# Altium schematic sheet Sheet1.SchDoc
size A; SheetNumber: 1; SheetTotal: 1
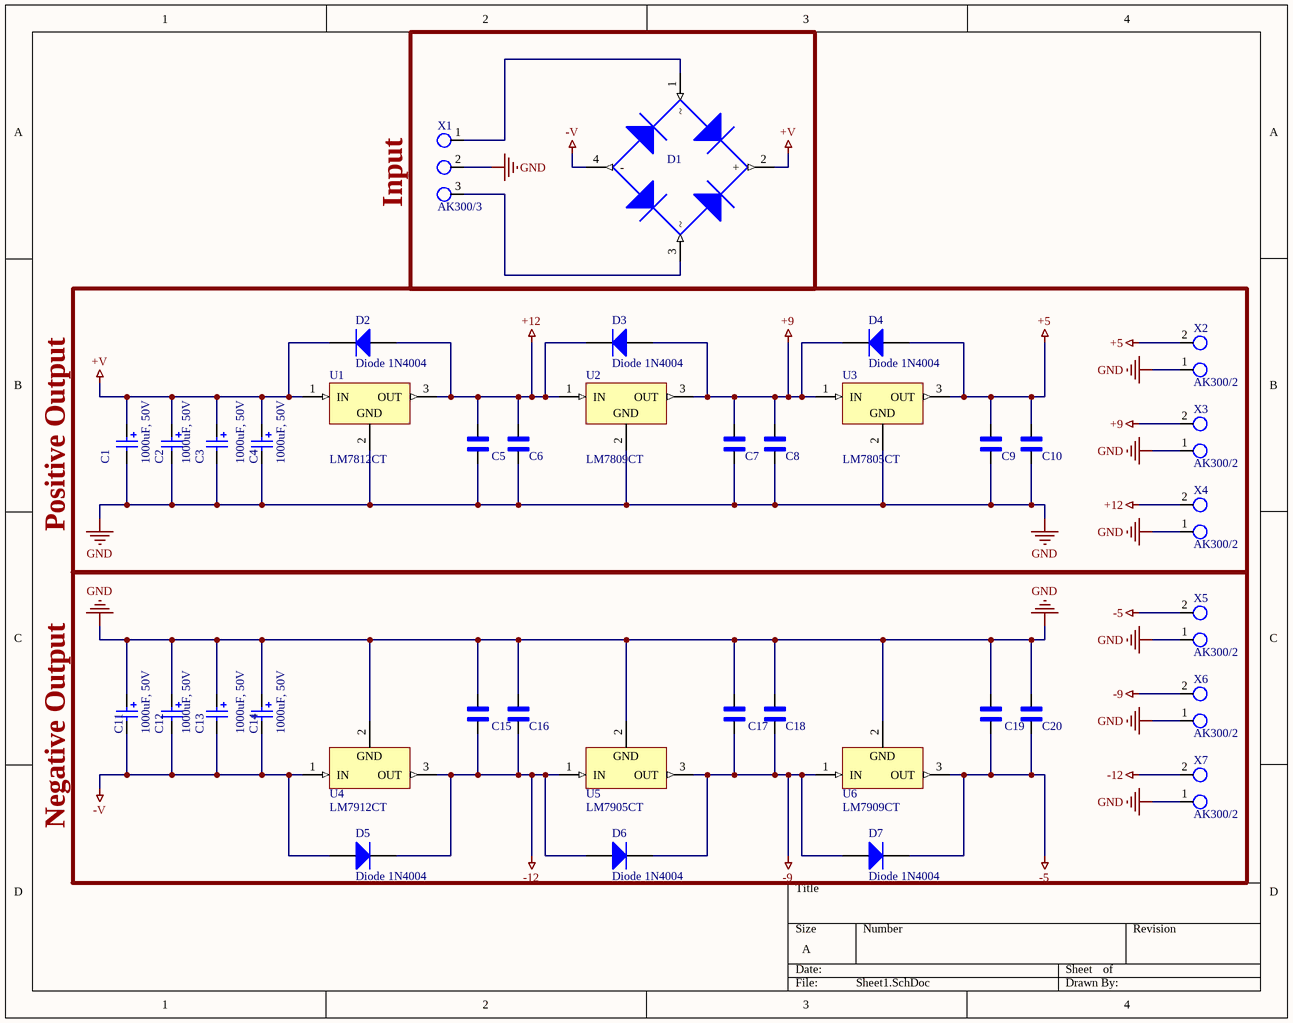
[diagram p0: Sheet1.SchDoc]

## Parts
C1  1000uF, 50V  [WCAP-ATG8_D13H25]
C2  1000uF, 50V  [WCAP-ATG8_D13H25]
C3  1000uF, 50V  [WCAP-ATG8_D13H25]
C4  1000uF, 50V  [WCAP-ATG8_D13H25]
C5  RDE5C2A220J0M1H03A  [CAP_RDE5C2A220J0M1H03A]  (value not drawn)
C6  RDE5C2A220J0M1H03A  [CAP_RDE5C2A220J0M1H03A]  (value not drawn)
C7  RDE5C2A220J0M1H03A  [CAP_RDE5C2A220J0M1H03A]  (value not drawn)
C8  RDE5C2A220J0M1H03A  [CAP_RDE5C2A220J0M1H03A]  (value not drawn)
C9  RDE5C2A220J0M1H03A  [CAP_RDE5C2A220J0M1H03A]  (value not drawn)
C10  RDE5C2A220J0M1H03A  [CAP_RDE5C2A220J0M1H03A]  (value not drawn)
C11  1000uF, 50V  [WCAP-ATG8_D13H25]
C12  1000uF, 50V  [WCAP-ATG8_D13H25]
C13  1000uF, 50V  [WCAP-ATG8_D13H25]
C14  1000uF, 50V  [WCAP-ATG8_D13H25]
C15  RDE5C2A220J0M1H03A  [CAP_RDE5C2A220J0M1H03A]  (value not drawn)
C16  RDE5C2A220J0M1H03A  [CAP_RDE5C2A220J0M1H03A]  (value not drawn)
C17  RDE5C2A220J0M1H03A  [CAP_RDE5C2A220J0M1H03A]  (value not drawn)
C18  RDE5C2A220J0M1H03A  [CAP_RDE5C2A220J0M1H03A]  (value not drawn)
C19  RDE5C2A220J0M1H03A  [CAP_RDE5C2A220J0M1H03A]  (value not drawn)
C20  RDE5C2A220J0M1H03A  [CAP_RDE5C2A220J0M1H03A]  (value not drawn)
D1  2W10G  [2W10G]  (value not drawn)
D2  Diode 1N4004  [DO-41]
D3  Diode 1N4004  [DO-41]
D4  Diode 1N4004  [DO-41]
D5  Diode 1N4004  [DO-41]
D6  Diode 1N4004  [DO-41]
D7  Diode 1N4004  [DO-41]
U1  LM7812CT  [TO-220-P]
U2  LM7809CT  [TO-220-P]
U3  LM7805CT  [TO-220-P]
U4  LM7912CT  [TO-220-N]
U5  LM7905CT  [TO-220-N]
U6  LM7909CT  [TO-220-N]
X1  AK300/3  [AK300/3]
X2  AK300/2  [AK300/2]
X3  AK300/2  [AK300/2]
X4  AK300/2  [AK300/2]
X5  AK300/2  [AK300/2]
X6  AK300/2  [AK300/2]
X7  AK300/2  [AK300/2]

## Blocks framed on the sheet
Input: D1 X1
Positive Output: C1-C10 D2-D4 U1-U3 X2-X4
Negative Output: C11-C20 D5-D7 U4-U6 X5-X7

## Nets
+5: C9.2 C10.2 D4.1(A) U3.3(OUT) X2.2(KL)
+9: C7.2 C8.2 D3.1(A) D4.2(K) U2.3(OUT) U3.1(IN) X3.2(KL)
+12: C5.2 C6.2 D2.1(A) D3.2(K) U1.3(OUT) U2.1(IN) X4.2(KL)
+V: C1.1(P) C2.1(P) C3.1(P) C4.1(P) D1.2(+) D2.2(K) U1.1(IN)
-5: C19.1 C20.1 D7.2(K) U6.3(OUT) X5.2(KL)
-9: C17.1 C18.1 D6.2(K) D7.1(A) U5.3(OUT) U6.1(IN) X6.2(KL)
-12: C15.1 C16.1 D5.2(K) D6.1(A) U4.3(OUT) U5.1(IN) X7.2(KL)
-V: C11.2(N) C12.2(N) C13.2(N) C14.2(N) D1.4(-) D5.1(A) U4.1(IN)
GND: C1.2(N) C2.2(N) C3.2(N) C4.2(N) C5.1 C6.1 C7.1 C8.1 C9.1 C10.1 C11.1(P) C12.1(P) C13.1(P) C14.1(P) C15.2 C16.2 C17.2 C18.2 C19.2 C20.2 U1.2(GND) U2.2(GND) U3.2(GND) U4.2(GND) U5.2(GND) U6.2(GND) X1.2(KL) X2.1(KL) X3.1(KL) X4.1(KL) X5.1(KL) X6.1(KL) X7.1(KL)
NetD1_1: D1.1 X1.1(KL)
NetD1_3: D1.3 X1.3(KL)

## Library data of the parts
C1-C4 C11-C14 = 860010678024: WCAP-ATG8 Aluminum Electrolytic Capacitor, Radial, THT, D13xH25, 1000uF, 50V; Manufacturer: Wurth Elektronik; Ripple Current: 1485mA; Rated Voltage: 50VDC; Technical Reference: ATBI250102M050DSPACB000; Leakage Current: 500uA; Endurance: 2000h; Dissipation Factor: 10%; Capacitance Tolerance: +/-20%; ComponentLink2Description: Datasheet; Published Date: October 2020; Packaging: Ammo Pack; Operating Temperature: -40 to +85degC; Mounting Technology: THT; Manufacturer Part Number: 860010678024; Height: 25mm; Diameter: 13mm; ComponentLink2URL: https://www.we-online.com/catalog/datasheet/860010678024.pdf; ComponentLink1URL: http://www.we-online.de; ComponentLink1Description: Manufacturer; Capacitance: 1000uF
C5-C10 C15-C20 = RDE5C2A220J0M1H03A: Lead Capacitor C0G_EIA_ with Capacitance: 22pF and Rated Voltage: 100Vdc; MF: Murata; Availability: Unavailable; Price: None; Package: Radial Murata; Value: *; SnapEDA_Link: https://www.snapeda.com/parts/RDE5C2A220J0M1H03A/Murata/view-part/4545539/?ref=snap; MP: RDE5C2A220J0M1H03A
D2-D7 = Diode 1N4004: 1 Amp General Purpose Rectifier; Published: 8-Jun-2000; LatestRevisionDate: 17-Jul-2002; LatestRevisionNote: Re-released for DXP Platform.; DatasheetVersion: 1998; PackageVersion: Aug-1999; PackageReference: DO-41; Publisher: Altium Limited; PackageDescription: Diode, Axial; Body 5.2 x 2.7 mm (LxDia. max), Lead Dia. 0.86 mm (max); Code_JEDEC: DO-204-AL; ComponentLink1Description: Manufacturer Link; ComponentLink1URL: http://www.fairchildsemi.com/; ComponentLink2Description: Datasheet; ComponentLink2URL: http://www.fairchildsemi.com/ds/1N%2F1N4001.pdf
U1 = 7812: Manufacturer: FairchildSemiconductor; Maximum Input Voltage: 35V; Maximum Quiescent Current: 8mA; Load Regulation: 100mV; Polarity: Positive; Maximum Output Current: 2.2(Typ)A; Output Type: Fixed; Typical Dropout Voltage @ Current: 2@1AV; Rad Hard: No; Output Voltage: 5V; Accuracy: ±4%; Number of Outputs: 1; Category: LinearRegulator; Package Description: 3-Pin Through Hole Device, Body 10 x 4.5 mm, Pitch 2.54 mm; Packaging: Rail/Tube; Mounting: ThroughHole; Manufacturer URL: https://www.fairchildsemi.com/; Line Regulation: 100mV; Datasheet Version: Aug-12; Datasheet URL: https://datasheet.ciiva.com/26904/lm7805ct-26904988.pdf; Package Reference: TO-220; Package URL: https://www.fairchildsemi.com/package-drawings/TO/TO220B03.pdf; Package: 3TO-220AB; Operating Temperature: -40to125degC; Type: Linear
U2 = 7809: Manufacturer: FairchildSemiconductor; Maximum Input Voltage: 35V; Maximum Quiescent Current: 8mA; Load Regulation: 100mV; Polarity: Positive; Maximum Output Current: 2.2(Typ)A; Output Type: Fixed; Typical Dropout Voltage @ Current: 2@1AV; Rad Hard: No; Output Voltage: 5V; Accuracy: ±4%; Number of Outputs: 1; Category: LinearRegulator; Package Description: 3-Pin Through Hole Device, Body 10 x 4.5 mm, Pitch 2.54 mm; Packaging: Rail/Tube; Mounting: ThroughHole; Manufacturer URL: https://www.fairchildsemi.com/; Line Regulation: 100mV; Datasheet Version: Aug-12; Datasheet URL: https://datasheet.ciiva.com/26904/lm7805ct-26904988.pdf; Package Reference: TO-220; Package URL: https://www.fairchildsemi.com/package-drawings/TO/TO220B03.pdf; Package: 3TO-220AB; Operating Temperature: -40to125degC; Type: Linear
U3 = 7805: Positive Voltage Regulator, 5 V, 1 A, -40 to 125 degC, 3-Pin TO-220, RoHS, Tube; Manufacturer: FairchildSemiconductor; Maximum Input Voltage: 35V; Maximum Quiescent Current: 8mA; Load Regulation: 100mV; Maximum Output Current: 2.2(Typ)A; Output Type: Fixed; Typical Dropout Voltage @ Current: 2@1AV; Rad Hard: No; Output Voltage: 5V; Accuracy: ±4%; Number of Outputs: 1; Category: LinearRegulator; Package Description: 3-Pin Through Hole Device, Body 10 x 4.5 mm, Pitch 2.54 mm; Packaging: Rail/Tube; Mounting: ThroughHole; Polarity: Positive; Manufacturer URL: https://www.fairchildsemi.com/; Line Regulation: 100mV; Datasheet Version: Aug-12; Datasheet URL: https://datasheet.ciiva.com/26904/lm7805ct-26904988.pdf; Package Reference: TO-220; Package URL: https://www.fairchildsemi.com/package-drawings/TO/TO220B03.pdf; Package: 3TO-220AB; Operating Temperature: -40to125degC; Type: Linear
U4 = 7912: Manufacturer: FairchildSemiconductor; Maximum Input Voltage: 35V; Maximum Quiescent Current: 8mA; Load Regulation: 100mV; Polarity: Positive; Maximum Output Current: 2.2(Typ)A; Output Type: Fixed; Typical Dropout Voltage @ Current: 2@1AV; Rad Hard: No; Output Voltage: 5V; Accuracy: ±4%; Number of Outputs: 1; Category: LinearRegulator; Package Description: 3-Pin Through Hole Device, Body 10 x 4.5 mm, Pitch 2.54 mm; Packaging: Rail/Tube; Mounting: ThroughHole; Manufacturer URL: https://www.fairchildsemi.com/; Line Regulation: 100mV; Datasheet Version: Aug-12; Datasheet URL: https://datasheet.ciiva.com/26904/lm7805ct-26904988.pdf; Package Reference: TO-220; Package URL: https://www.fairchildsemi.com/package-drawings/TO/TO220B03.pdf; Package: 3TO-220AB; Operating Temperature: -40to125degC; Type: Linear
U5 = 7905: Negative Voltage Regulator, 5 V, 1 A, -40 to 125 degC, 3-Pin TO-220, RoHS, Tube; Manufacturer: FairchildSemiconductor; Maximum Input Voltage: 35V; Maximum Quiescent Current: 8mA; Load Regulation: 100mV; Polarity: Positive; Maximum Output Current: 2.2(Typ)A; Output Type: Fixed; Typical Dropout Voltage @ Current: 2@1AV; Rad Hard: No; Output Voltage: 5V; Accuracy: ±4%; Number of Outputs: 1; Category: LinearRegulator; Package Description: 3-Pin Through Hole Device, Body 10 x 4.5 mm, Pitch 2.54 mm; Packaging: Rail/Tube; Mounting: ThroughHole; Manufacturer URL: https://www.fairchildsemi.com/; Line Regulation: 100mV; Datasheet Version: Aug-12; Datasheet URL: https://datasheet.ciiva.com/26904/lm7805ct-26904988.pdf; Package Reference: TO-220; Package URL: https://www.fairchildsemi.com/package-drawings/TO/TO220B03.pdf; Package: 3TO-220AB; Operating Temperature: -40to125degC; Type: Linear
U6 = 7909: Manufacturer: FairchildSemiconductor; Maximum Input Voltage: 35V; Maximum Quiescent Current: 8mA; Load Regulation: 100mV; Polarity: Positive; Maximum Output Current: 2.2(Typ)A; Output Type: Fixed; Typical Dropout Voltage @ Current: 2@1AV; Rad Hard: No; Output Voltage: 5V; Accuracy: ±4%; Number of Outputs: 1; Category: LinearRegulator; Package Description: 3-Pin Through Hole Device, Body 10 x 4.5 mm, Pitch 2.54 mm; Packaging: Rail/Tube; Mounting: ThroughHole; Manufacturer URL: https://www.fairchildsemi.com/; Line Regulation: 100mV; Datasheet Version: Aug-12; Datasheet URL: https://datasheet.ciiva.com/26904/lm7805ct-26904988.pdf; Package Reference: TO-220; Package URL: https://www.fairchildsemi.com/package-drawings/TO/TO220B03.pdf; Package: 3TO-220AB; Operating Temperature: -40to125degC; Type: Linear
X1 = AK300/3: MF: Altech; MP: AK300/3; Package: None; Availability: Unavailable; SnapEDA_Link: https://www.snapeda.com/parts/AK300/3/Altech/view-part/2748485/?ref=snap; Check_prices: https://www.snapeda.com/parts/AK300/3/Altech/view-part/2748485/?ref=eda; Value: *; Price: None
X2-X7 = AK300/2: MP: AK300/3; MF: Altech; Package: None; Availability: Unavailable; SnapEDA_Link: https://www.snapeda.com/parts/AK300/3/Altech/view-part/2748485/?ref=snap; Check_prices: https://www.snapeda.com/parts/AK300/3/Altech/view-part/2748485/?ref=eda; Value: *; Price: None